# Altium project MClock.PrjPcb
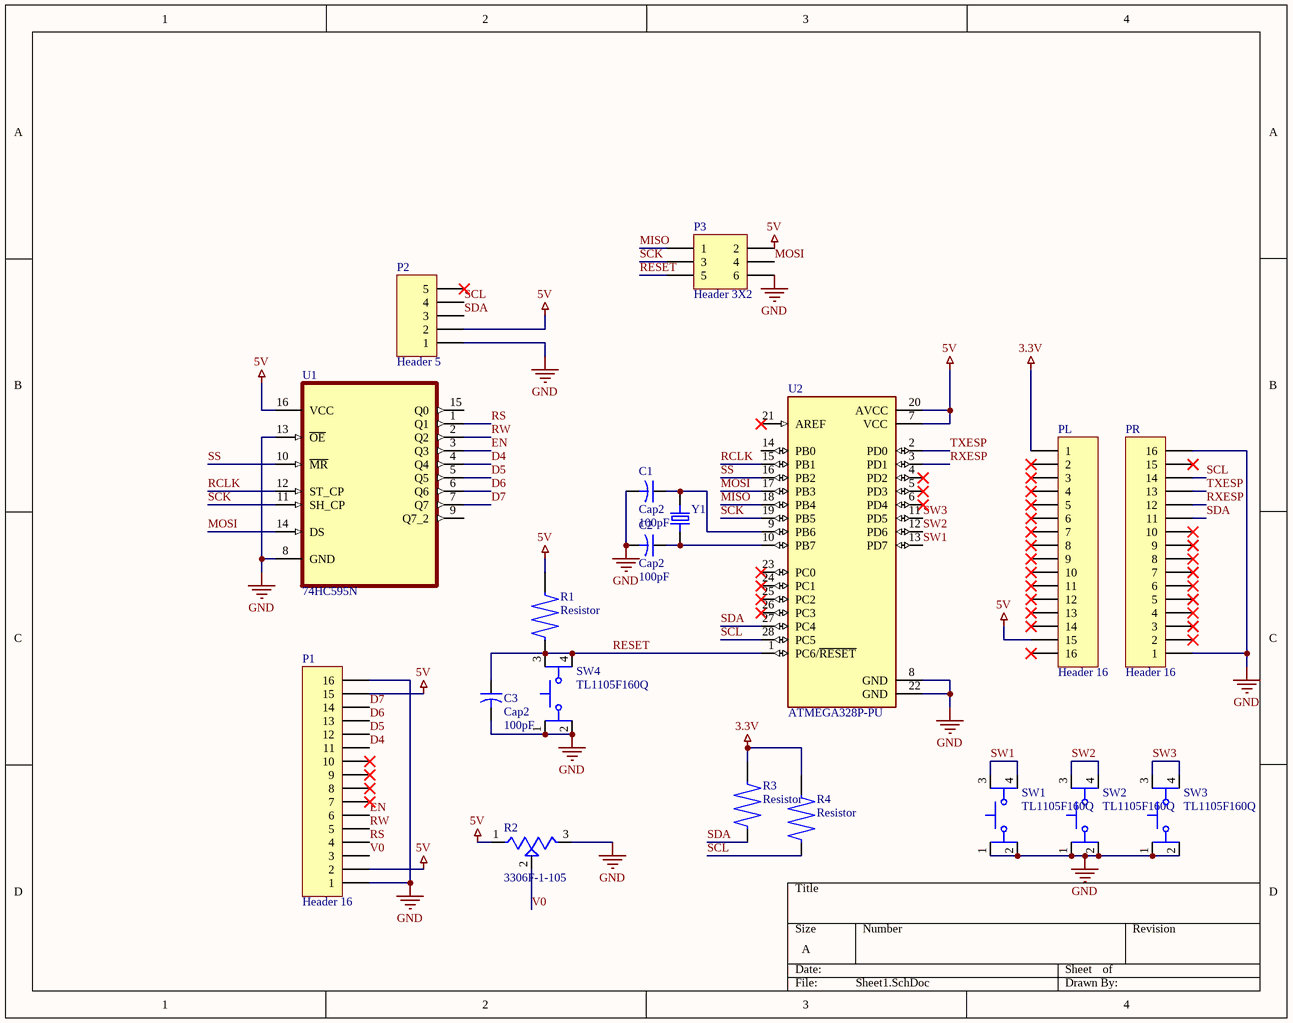
[diagram p0: Sheet1.SchDoc]
1 sheet, 19 parts. Net scope: global (net labels, ports and power ports of the same name join across sheets).
Board file: PCB1.PcbDoc

## Sheet Sheet1.SchDoc
size A; SheetNumber: 1; SheetTotal: 1

### Parts
C1  Cap2  value 100pF  [CAPR5-4X5]
C2  Cap2  value 100pF  [CAPR5-4X5]
C3  Cap2  value 100pF  [CAPR5-4X5]
P1  Header 16  [HDR1X16]
P2  Header 5  [HDR1X5]
P3  Header 3X2  [HDR2X3]
PL  Header 16  [HDR1X16]
PR  Header 16  [HDR1X16]
R1  Resistor  [StandingAxial]
R2  3306F-1-105  [TRIM_3306F-1-105]
R3  Resistor  [StandingAxial]
R4  Resistor  [StandingAxial]
SW1  TL1105F160Q  [SW_TL1105F160Q]
SW2  TL1105F160Q  [SW_TL1105F160Q]
SW3  TL1105F160Q  [SW_TL1105F160Q]
SW4  TL1105F160Q  [SW_TL1105F160Q]
U1  74HC595N  [DIP254P762X420-16]
U2  ATMEGA328P-PU  [DIP794W46P254L2967H457Q28B]
Y1  ECS-160-S-4  [XTAL_ECS-160-20-4X]  (value not drawn)

### Nets
3.3V: PL.1 R3.1 R4.1
5V: P1.2 P1.15 P2.2 P3.2 PL.15 R1.1 R2.1(CCW) U1.16(VCC) U2.7(VCC) U2.20(AVCC)
GND: C1.2 C2.2 C3.2 P1.1 P1.16 P2.1 P3.6 PR.1 PR.16 R2.3(CW) SW1.1 SW1.2 SW2.1 SW2.2 SW3.1 SW3.2 SW4.1 SW4.2 U1.8(GND) U1.13(~{OE}) U2.8(GND) U2.22(GND)
D4: P1.11 U1.4(Q4)
D5: P1.12 U1.5(Q5)
D6: P1.13 U1.6(Q6)
D7: P1.14 U1.7(Q7)
EN: P1.6 U1.3(Q3)
MISO: P3.1 U2.18(PB4)
MOSI: P3.4 U1.14(DS) U2.17(PB3)
RCLK: U1.12(ST_CP) U2.15(PB1)
RESET: C3.1 P3.5 R1.0 SW4.3 SW4.4 U2.1(PC6/~{RESET})
RS: P1.4 U1.1(Q1)
RW: P1.5 U1.2(Q2)
RXESP: PR.12 U2.3(PD1)
SCK: P3.3 U1.11(SH_CP) U2.19(PB5)
SCL: P2.4 PR.14 R4.0 U2.28(PC5)
SDA: P2.3 PR.11 R3.0 U2.27(PC4)
SS: U1.10(~{MR}) U2.16(PB2)
SW1: SW1.3 SW1.4 U2.13(PD7)
SW2: SW2.3 SW2.4 U2.12(PD6)
SW3: SW3.3 SW3.4 U2.11(PD5)
TXESP: PR.13 U2.2(PD0)
V0: P1.3 R2.2(WIPER)
NetC1_1: C1.1 U2.9(PB6) Y1.2
NetC2_1: C2.1 U2.10(PB7) Y1.1

Not connected (* = marked no-connect by the designer): P1 7* 8* 9* 10*; P2 5*; PL 2* 3* 4* 5* 6* 7* 8* 9* 10* 11* 12* 13* 14* 16*; PR 2* 3* 4* 5* 6* 7* 8* 9* 10* 15*; U1 9(Q7_2) 15(Q0); U2 4(PD2)* 5(PD3)* 6(PD4)* 14(PB0) 21(AREF)* 23(PC0)* 24(PC1)* 25(PC2)* 26(PC3)*

### Library data of the parts
C1-C3 = Cap2: Capacitor; Published: 23-Sep-2002; PackageReference: CAPR5-4X5; Publisher: Altium Limited; PackageDescription: Capacitor; 2 Leads
P1 PL PR = Header 16: Header, 16-Pin; LatestRevisionDate: 17-Jul-2002; LatestRevisionNote: Re-released for DXP Platform.; Publisher: Altium Limited
P2 = Header 5: Header, 5-Pin; LatestRevisionDate: 17-Jul-2002; LatestRevisionNote: Re-released for DXP Platform.; Publisher: Altium Limited
P3 = Header 3X2: Header, 3-Pin, Dual row; LatestRevisionDate: 17-Jul-2002; LatestRevisionNote: Re-released for DXP Platform.; Publisher: Altium Limited
R2 = 3306F-1-105: 1 MOhms 0.2W, 1/5W PC Pins Through Hole Trimmer Potentiometer Cermet 1 Turn Top Adjustment
U1 = 74HC595N: Shift Shift Register 1 Element 8 Bit 16-DIP
U2 = ATMEGA328P-PU: ATmega Series 20 MHz 32 KB Flash 2 KB SRAM 8-Bit Microcontroller - DIP-28; MP: ATMEGA328P-PU; Package: None; Availability: Unavailable; Price: None; Value: *
Y1 = ECS-160-S-4: 16MHz Â±30ppm Crystal Series 40 Ohms HC-49/US